# Altium project 175-00060, rev1, NRES Temp Meas, 8-Chan RTD.PrjPcb
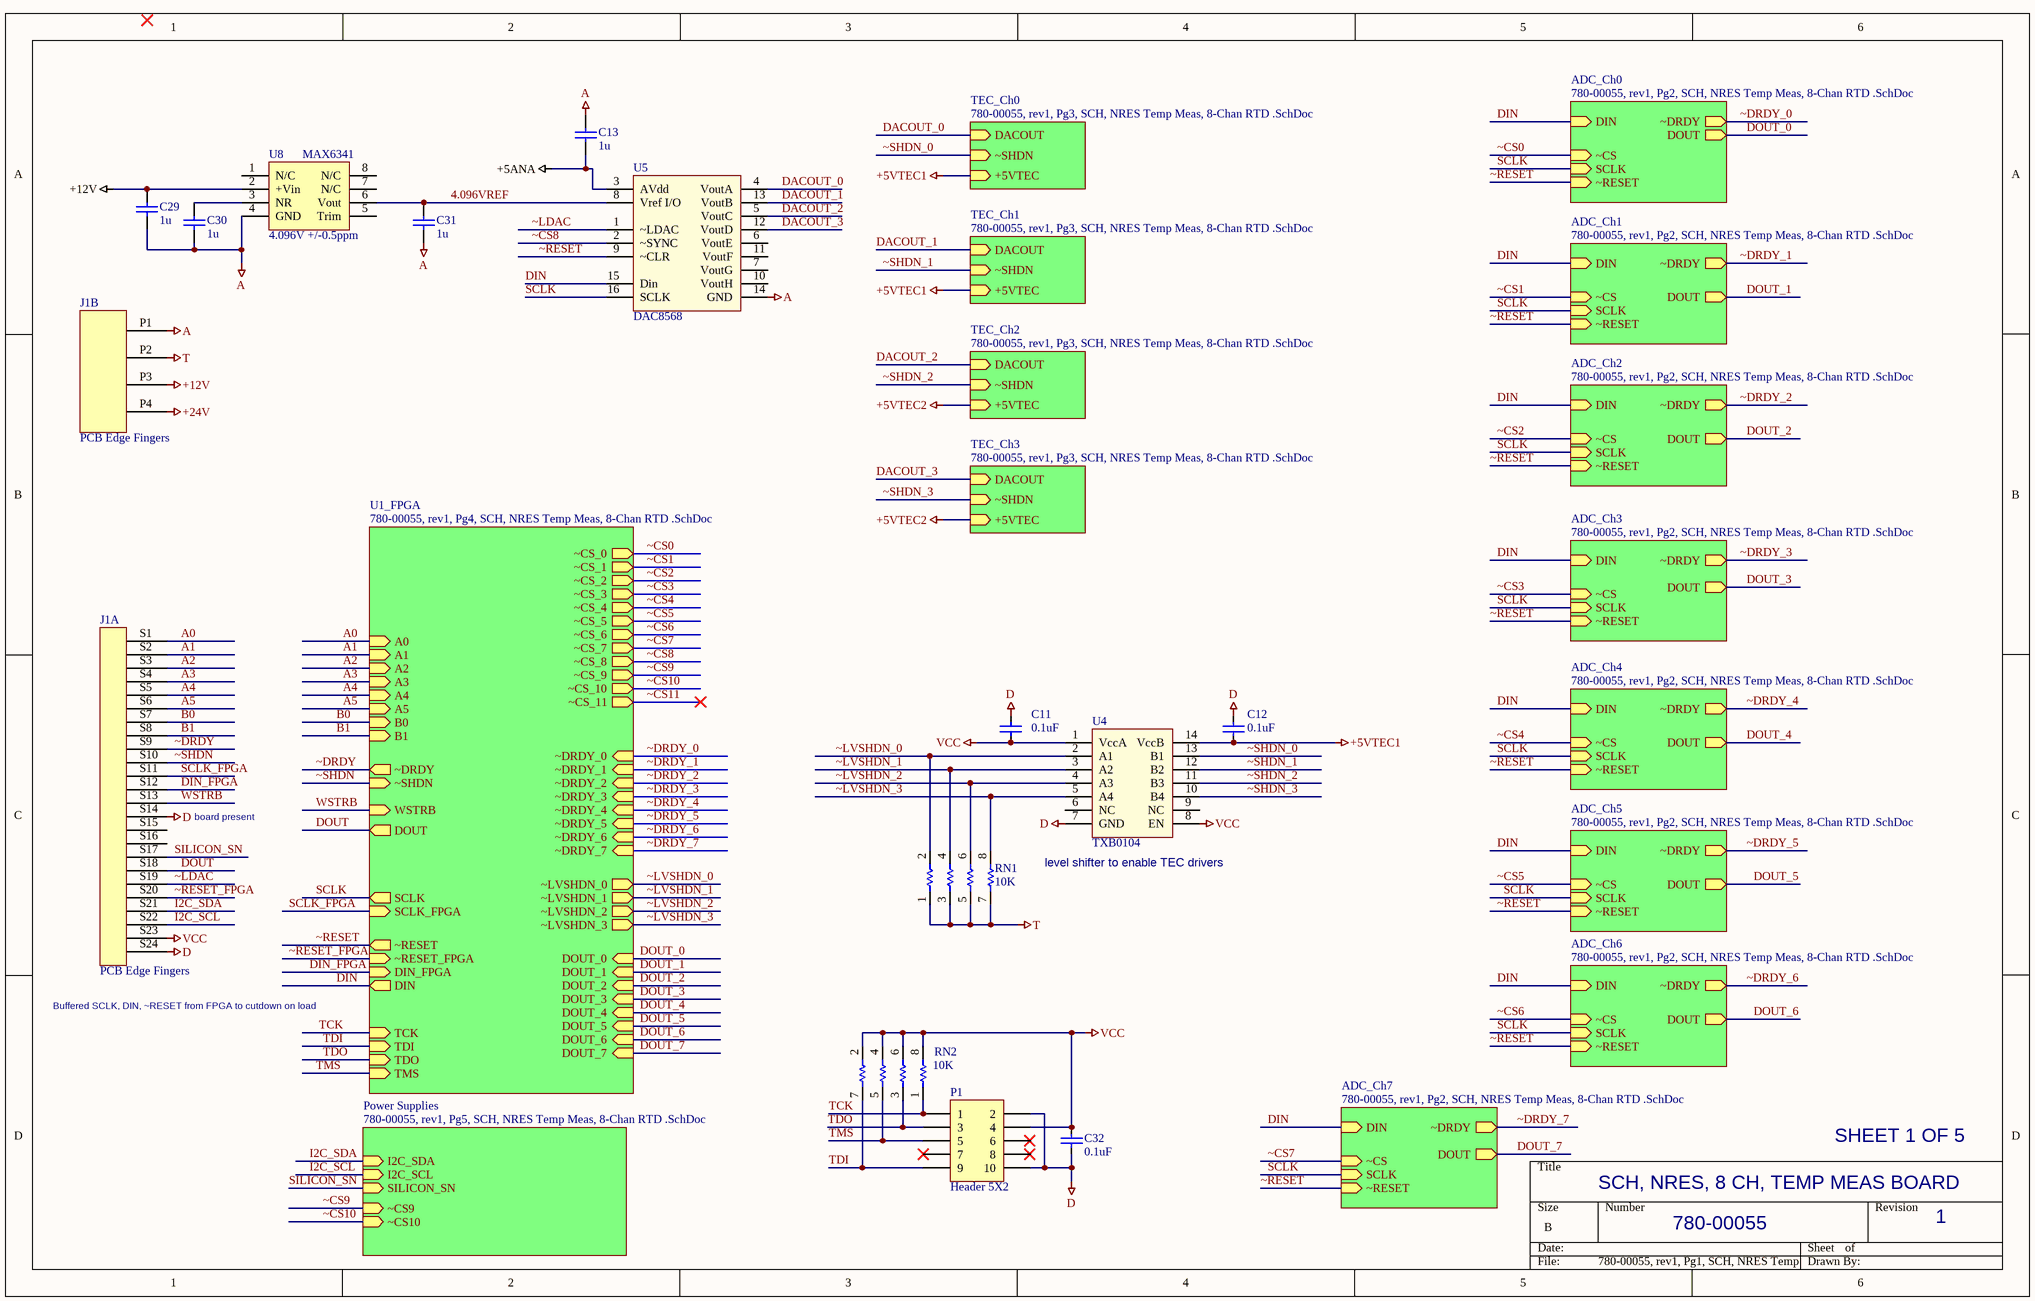
[diagram p0: 780-00055, rev1, Pg1, SCH, NRES Temp Meas, 8-Chan RTD .SchDoc]
4 sheets, 118 parts. Net scope: hierarchical (ports join the sheet entries above them; power ports are global).
Board file: 175-00060, rev1, PCB, NRES RTD_TEC Board.PcbDoc
Sheets:
  780-00055, rev1, Pg1, SCH, NRES Temp Meas, 8-Chan RTD .SchDoc
    TEC_Ch0 = 780-00055, rev1, Pg3, SCH, NRES Temp Meas, 8-Chan RTD .SchDoc
    TEC_Ch1 = 780-00055, rev1, Pg3, SCH, NRES Temp Meas, 8-Chan RTD .SchDoc
    TEC_Ch2 = 780-00055, rev1, Pg3, SCH, NRES Temp Meas, 8-Chan RTD .SchDoc
    TEC_Ch3 = 780-00055, rev1, Pg3, SCH, NRES Temp Meas, 8-Chan RTD .SchDoc
    U1_FPGA = 780-00055, rev1, Pg4, SCH, NRES Temp Meas, 8-Chan RTD .SchDoc
    Power Supplies = 780-00055, rev1, Pg5, SCH, NRES Temp Meas, 8-Chan RTD .SchDoc

## Sheet 780-00055, rev1, Pg1, SCH, NRES Temp Meas, 8-Chan RTD .SchDoc
size B; PageSetup: Record=PageOptions|CenterHorizontal=True|CenterVertical=True|PrintScale=1.09|XCorrection=1.00|YCorrection=1.00|PrintKind=0|BorderSize=5000000|LeftOffset=0|BottomOffset=0|Orientation=2|PaperLength=1000|PaperWidth=1000|Scale=100|PaperSource=7|PrintQuality=-4|MediaType=1|DitherType=10|PaperKind=Ledger|PrintScaleMode=1

### Parts
C11  value 0.1uF  [SMD_0805]  (hidden comment: Cap SMD)
C12  value 0.1uF  [SMD_0805]  (hidden comment: Cap SMD)
C13  1u  [SMD_0805]
C29  1u  [SMD_0805]
C30  1u  [SMD_0805]
C31  1u  [SMD_0805]
C32  value 0.1uF  [SMD_0805]  (hidden comment: Cap SMD)
J1  PCB Edge Fingers  [PCB EDGE, MOLEX 46114]  (parts A,B of 2)
P1  Header 5X2  [HDR2X5]
RN1  value 10K  [RES ARRAY 0603 x 4]  (hidden comment: RES ARRAY  x4 10K)
RN2  value 10K  [RES ARRAY 0603 x 4]  (hidden comment: RES ARRAY  x4)
U4  TXB0104  [TSSOP14]
U5  DAC8568  [TSSOP16]
U8  4.096V +/-0.5ppm  value MAX6341  [SO-8_M]

### Sub-sheets
ADC_Ch0 = 780-00055, rev1, Pg2, SCH, NRES Temp Meas, 8-Chan RTD .SchDoc (file not in this document): SCLK (in), ~RESET (in), DIN (in), ~DRDY (out), DOUT (out), ~CS (in)
ADC_Ch1 = 780-00055, rev1, Pg2, SCH, NRES Temp Meas, 8-Chan RTD .SchDoc (file not in this document): SCLK (in), ~RESET (in), DIN (in), ~DRDY (out), ~CS (in), DOUT (out)
ADC_Ch2 = 780-00055, rev1, Pg2, SCH, NRES Temp Meas, 8-Chan RTD .SchDoc (file not in this document): SCLK (in), ~RESET (in), DIN (in), ~DRDY (out), ~CS (in), DOUT (out)
ADC_Ch3 = 780-00055, rev1, Pg2, SCH, NRES Temp Meas, 8-Chan RTD .SchDoc (file not in this document): SCLK (in), ~RESET (in), DIN (in), ~DRDY (out), ~CS (in), DOUT (out)
ADC_Ch4 = 780-00055, rev1, Pg2, SCH, NRES Temp Meas, 8-Chan RTD .SchDoc (file not in this document): SCLK (in), ~RESET (in), DIN (in), ~DRDY (out), ~CS (in), DOUT (out)
ADC_Ch5 = 780-00055, rev1, Pg2, SCH, NRES Temp Meas, 8-Chan RTD .SchDoc (file not in this document): SCLK (in), ~RESET (in), DIN (in), ~DRDY (out), ~CS (in), DOUT (out)
ADC_Ch6 = 780-00055, rev1, Pg2, SCH, NRES Temp Meas, 8-Chan RTD .SchDoc (file not in this document): SCLK (in), ~RESET (in), DIN (in), ~DRDY (out), ~CS (in), DOUT (out)
ADC_Ch7 = 780-00055, rev1, Pg2, SCH, NRES Temp Meas, 8-Chan RTD .SchDoc (file not in this document): SCLK (in), ~RESET (in), DIN (in), ~DRDY (out), ~CS (in), DOUT (out)
Power Supplies = 780-00055, rev1, Pg5, SCH, NRES Temp Meas, 8-Chan RTD .SchDoc: I2C_SDA (in), I2C_SCL (in), SILICON_SN (in), ~CS9 (in), ~CS10 (in)
TEC_Ch0 = 780-00055, rev1, Pg3, SCH, NRES Temp Meas, 8-Chan RTD .SchDoc: ~SHDN (in), DACOUT (in), +5VTEC (in)
TEC_Ch1 = 780-00055, rev1, Pg3, SCH, NRES Temp Meas, 8-Chan RTD .SchDoc: ~SHDN (in), DACOUT (in), +5VTEC (in)
TEC_Ch2 = 780-00055, rev1, Pg3, SCH, NRES Temp Meas, 8-Chan RTD .SchDoc: ~SHDN (in), DACOUT (in), +5VTEC (in)
TEC_Ch3 = 780-00055, rev1, Pg3, SCH, NRES Temp Meas, 8-Chan RTD .SchDoc: ~SHDN (in), DACOUT (in), +5VTEC (in)
U1_FPGA = 780-00055, rev1, Pg4, SCH, NRES Temp Meas, 8-Chan RTD .SchDoc: ~CS_0 (out), ~CS_1 (out), ~CS_2 (out), ~CS_3 (out), ~CS_4 (out), ~CS_5 (out), ~CS_6 (out), ~CS_7 (out), ~CS_8 (out), ~DRDY (out), ~DRDY_0 (in), ~DRDY_1 (in), ~DRDY_2 (in), ~DRDY_3 (in), ~DRDY_4 (in), ~DRDY_5 (in), ~DRDY_6 (in), ~DRDY_7 (in), ~LVSHDN_0 (out), ~LVSHDN_1 (out), ~LVSHDN_2 (out), ~LVSHDN_3 (out), ~SHDN (in), A0 (in), A1 (in), A2 (in), A3 (in), A4 (in), A5 (in), B0 (in), B1 (in), TCK (in), TDI (in), TDO (in), TMS (in), WSTRB (in), DOUT (out), ~CS_9 (out), ~CS_10 (out), ~CS_11 (out), DOUT_2 (in), DOUT_4 (in), DOUT_1 (in), DOUT_6 (in), DOUT_3 (in), DOUT_7 (in), DOUT_0 (in), DOUT_5 (in), SCLK (out), SCLK_FPGA (in), ~RESET (out), ~RESET_FPGA (in), DIN_FPGA (in), DIN (out)

### Nets
+5ANA: C13.2 U5.3(AVdd)
+5VTEC1: C12.1 U4.14(VccB) ; sheet TEC_Ch0/+5VTEC, sheet TEC_Ch1/+5VTEC
+5VTEC2: sheet TEC_Ch2/+5VTEC, sheet TEC_Ch3/+5VTEC
+12V: C29.1 J1.P3(S27) U8.2(+Vin)
+24V: J1.P4(S28)
A: C13.1 C29.2 C30.2 C31.2 J1.P1(S25) U5.14(GND) U8.4(GND)
D: C11.2 C12.2 C32.1 J1.S14 J1.S24 P1.2 P1.10 U4.7(GND)
T: J1.P2(S26) RN1.1 RN1.3 RN1.5 RN1.7
VCC: C11.1 C32.2 J1.S23 P1.4 RN2.2 RN2.4 RN2.6 RN2.8 U4.1(VccA) U4.8(EN)
4.096VREF: C31.1 U5.8(Vref_I/O) U8.6(Vout)
A0: J1.S1 ; sheet U1_FPGA/A0
A1: J1.S2 ; sheet U1_FPGA/A1
A2: J1.S3 ; sheet U1_FPGA/A2
A3: J1.S4 ; sheet U1_FPGA/A3
A4: J1.S5 ; sheet U1_FPGA/A4
A5: J1.S6 ; sheet U1_FPGA/A5
B0: J1.S7 ; sheet U1_FPGA/B0
B1: J1.S8 ; sheet U1_FPGA/B1
DACOUT_0: U5.4(VoutA) ; sheet TEC_Ch0/DACOUT  [project net DACOUT]
DACOUT_1: U5.13(VoutB) ; sheet TEC_Ch1/DACOUT  [project net DACOUT]
DACOUT_2: U5.5(VoutC) ; sheet TEC_Ch2/DACOUT  [project net DACOUT]
DACOUT_3: U5.12(VoutD) ; sheet TEC_Ch3/DACOUT  [project net DACOUT]
DIN: U5.15(Din) ; sheet ADC_Ch3/DIN, sheet ADC_Ch4/DIN, sheet ADC_Ch5/DIN, sheet ADC_Ch6/DIN, sheet ADC_Ch7/DIN, sheet ADC_Ch0/DIN, sheet ADC_Ch1/DIN, sheet ADC_Ch2/DIN, sheet U1_FPGA/DIN
DIN_FPGA: J1.S12 ; sheet U1_FPGA/DIN_FPGA
DOUT: J1.S18 ; sheet U1_FPGA/DOUT
DOUT_0: sheet ADC_Ch0/DOUT, sheet U1_FPGA/DOUT_0
DOUT_1: sheet ADC_Ch1/DOUT, sheet U1_FPGA/DOUT_1
DOUT_2: sheet ADC_Ch2/DOUT, sheet U1_FPGA/DOUT_2
DOUT_3: sheet ADC_Ch3/DOUT, sheet U1_FPGA/DOUT_3
DOUT_4: sheet ADC_Ch4/DOUT, sheet U1_FPGA/DOUT_4
DOUT_5: sheet ADC_Ch5/DOUT, sheet U1_FPGA/DOUT_5
DOUT_6: sheet ADC_Ch6/DOUT, sheet U1_FPGA/DOUT_6
DOUT_7: sheet ADC_Ch7/DOUT, sheet U1_FPGA/DOUT_7
I2C_SCL: J1.S22 ; sheet Power Supplies/I2C_SCL
I2C_SDA: J1.S21 ; sheet Power Supplies/I2C_SDA
SCLK: U5.16(SCLK) ; sheet ADC_Ch3/SCLK, sheet ADC_Ch4/SCLK, sheet ADC_Ch5/SCLK, sheet ADC_Ch6/SCLK, sheet ADC_Ch7/SCLK, sheet ADC_Ch0/SCLK, sheet ADC_Ch1/SCLK, sheet ADC_Ch2/SCLK, sheet U1_FPGA/SCLK
SCLK_FPGA: J1.S11 ; sheet U1_FPGA/SCLK_FPGA
SILICON_SN: J1.S17 ; sheet Power Supplies/SILICON_SN
TCK: P1.1 RN2.1 ; sheet U1_FPGA/TCK
TDI: P1.9 RN2.7 ; sheet U1_FPGA/TDI
TDO: P1.3 RN2.3 ; sheet U1_FPGA/TDO
TMS: P1.5 RN2.5 ; sheet U1_FPGA/TMS
WSTRB: J1.S13 ; sheet U1_FPGA/WSTRB
~CS0: sheet ADC_Ch0/~CS, sheet U1_FPGA/~CS_0
~CS1: sheet ADC_Ch1/~CS, sheet U1_FPGA/~CS_1
~CS2: sheet ADC_Ch2/~CS, sheet U1_FPGA/~CS_2
~CS3: sheet ADC_Ch3/~CS, sheet U1_FPGA/~CS_3
~CS4: sheet ADC_Ch4/~CS, sheet U1_FPGA/~CS_4
~CS5: sheet ADC_Ch5/~CS, sheet U1_FPGA/~CS_5
~CS6: sheet ADC_Ch6/~CS, sheet U1_FPGA/~CS_6
~CS7: sheet ADC_Ch7/~CS, sheet U1_FPGA/~CS_7
~CS8: U5.2(~SYNC) ; sheet U1_FPGA/~CS_8
~CS9: sheet U1_FPGA/~CS_9, sheet Power Supplies/~CS9
~CS10: sheet U1_FPGA/~CS_10, sheet Power Supplies/~CS10
~DRDY: J1.S9 ; sheet U1_FPGA/~DRDY
~DRDY_0: sheet ADC_Ch0/~DRDY, sheet U1_FPGA/~DRDY_0
~DRDY_1: sheet ADC_Ch1/~DRDY, sheet U1_FPGA/~DRDY_1
~DRDY_2: sheet ADC_Ch2/~DRDY, sheet U1_FPGA/~DRDY_2
~DRDY_3: sheet ADC_Ch3/~DRDY, sheet U1_FPGA/~DRDY_3
~DRDY_4: sheet ADC_Ch4/~DRDY, sheet U1_FPGA/~DRDY_4
~DRDY_5: sheet ADC_Ch5/~DRDY, sheet U1_FPGA/~DRDY_5
~DRDY_6: sheet ADC_Ch6/~DRDY, sheet U1_FPGA/~DRDY_6
~DRDY_7: sheet ADC_Ch7/~DRDY, sheet U1_FPGA/~DRDY_7
~LDAC: J1.S19 U5.1(~LDAC)
~LVSHDN_0: RN1.2 U4.2(A1) ; sheet U1_FPGA/~LVSHDN_0
~LVSHDN_1: RN1.4 U4.3(A2) ; sheet U1_FPGA/~LVSHDN_1
~LVSHDN_2: RN1.6 U4.4(A3) ; sheet U1_FPGA/~LVSHDN_2
~LVSHDN_3: RN1.8 U4.5(A4) ; sheet U1_FPGA/~LVSHDN_3
~RESET: U5.9(~CLR) ; sheet ADC_Ch3/~RESET, sheet ADC_Ch4/~RESET, sheet ADC_Ch5/~RESET, sheet ADC_Ch6/~RESET, sheet ADC_Ch7/~RESET, sheet ADC_Ch0/~RESET, sheet ADC_Ch1/~RESET, sheet ADC_Ch2/~RESET, sheet U1_FPGA/~RESET
~RESET_FPGA: J1.S20 ; sheet U1_FPGA/~RESET_FPGA
~SHDN: J1.S10 ; sheet U1_FPGA/~SHDN
~SHDN_0: U4.13(B1) ; sheet TEC_Ch0/~SHDN  [project net ~SHDN]
~SHDN_1: U4.12(B2) ; sheet TEC_Ch1/~SHDN  [project net ~SHDN]
~SHDN_2: U4.11(B3) ; sheet TEC_Ch2/~SHDN  [project net ~SHDN]
~SHDN_3: U4.10(B4) ; sheet TEC_Ch3/~SHDN  [project net ~SHDN]
NetC30_1: C30.1 U8.3(NR)

Not connected (* = marked no-connect by the designer): J1 S15 S16; P1 6 7* 8; U4 6(NC) 9(NC); U5 6(VoutE) 7(VoutG) 10(VoutH) 11(VoutF); U8 1(N/C) 5(Trim) 7(N/C) 8(N/C)

### Notes on the sheet
- board present
- level shifter to enable TEC drivers
- (near J1) Buffered SCLK, DIN, ~RESET from FPGA to cutdown on load
- SCH, NRES, 8 CH, TEMP MEAS BOARD
- SHEET 1 OF 5
- 780-00055
- 1

### Library data of the parts
C11 C12 = Cap SMD: Capacitor; LCO p/n: 120-00002
C13 C29-C31 = Cap: Capacitor; Manufacturer: Taiyo Yuden; Manuf p/n: UMK212F105ZG-T; Vendor: DIGIKEY; Vendor Mult.: 10; Vendor p/n: 587-1308-1-ND; LCO p/n: 120-00027; Value: 1u; COST: 0.088
C32 = Cap SMD: Capacitor; Manufacturer: AVX; Manuf p/n: 08055C104KAT2A; Vendor: DigiKey; Vendor p/n: 478-1395-1-ND; Vendor Mult.: 10; LCO P/N: 120-00002; COST: 0.088
J1 = Conn, PCB Card Edge / Molex 46114, 24 sig / 4 pwr: PCB Edge Conn to fit Molex 46114 backplane connector
P1 = Header 5X2: Header, 5-Pin, Dual row; Manufacturer: FCI; Manuf p/n: 67996-210HLF; Vendor: DigiKey; Vendor p/n: 609-3212-ND; Vendor Mult.: 1; LCO P/N: 125-00010; COST: 0.81; Value: Header 5X2
RN1 = RES ARRAY  x4 10K: Resistor Array 4 Isolated; Manufacturer: PANASONIC - ECG; Manuf p/n: EXB-38V103JV; Vendor: DIGIKEY; Vendor p/n: Y9103CT-ND; Vendor Mult.: 10; LCO p/n: 180-00043; COST: 0.03
RN2 = RES ARRAY  x4: Resistor Array 4 Isolated; Manufacturer: Panasonic ECG; Manuf p/n: EXB-38V103JV; Vendor: DigiKey; Vendor p/n: Y9103CT-ND; Vendor Mult.: 10; LCO P/N: 180-00043; COST: 0.031
U4 = TXB0104: 4-Chan Logic Level Shifter Bi-directional; Manufacturer: TI; Manuf p/n: TXB0104PWR; LCO p/n: 150-00108; Vendor: DK; Vendor p/n: 296-21929-1-ND; VALUE: TXB0104
U5 = DAC8568: 8 Chan, 16-bit DAC, SPI Interface; Manufacturer: TI; Manuf p/n: DAC8568IAPW; LCO p/n: 150-00107; Vendor: DK; Vendor p/n: 296-24444-5-ND; VALUE: DAC8568
U8 = MAX6341: VREF 4.096V 0.5ppm; Manufacturer: MAXIM; Manuf p/n: MAX6341CSA+; Vendor: DIGIKEY; Vendor p/n: MAX6341CSA+-ND; Vendor Mult.: 1; LCO p/n: 150-00052; COST: 17.76

## Sheet 780-00055, rev1, Pg3, SCH, NRES Temp Meas, 8-Chan RTD .SchDoc
size B; PageSetup: Record=PageOptions|CenterHorizontal=True|CenterVertical=True|PrintScale=1.09|XCorrection=1.00|YCorrection=1.00|PrintKind=0|BorderSize=5000000|LeftOffset=0|BottomOffset=0|Orientation=2|PaperLength=1000|PaperWidth=1000|Scale=100|PaperSource=7|PrintQuality=-4|MediaType=1|DitherType=10|PaperKind=Ledger|PrintScaleMode=1
Used 4 times, as channels TEC_Ch0, TEC_Ch1, TEC_Ch2, TEC_Ch3. Parts and nets are listed once, with the designators drawn on the sheet.
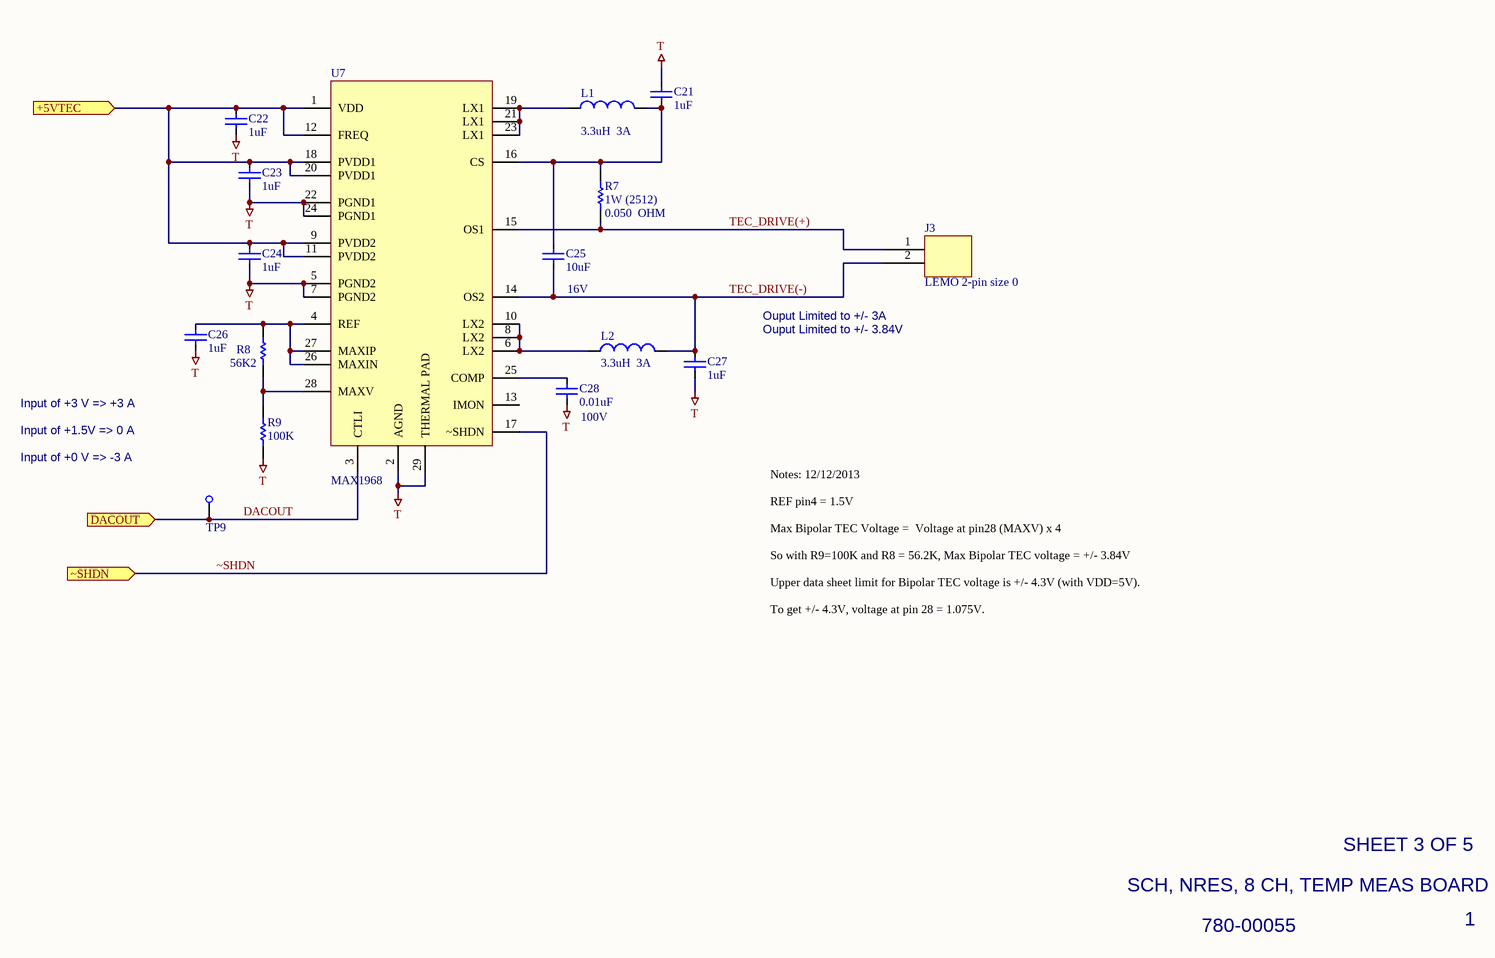
[diagram p1: 780-00055, rev1, Pg3, SCH, NRES Temp Meas, 8-Chan RTD .SchDoc]

### Parts
C21  value 1uF  [SMD_0805]  (hidden comment: Cap SMD)
C22  value 1uF  [SMD_0805]  (hidden comment: Cap SMD)
C23  value 1uF  [SMD_0805]  (hidden comment: Cap SMD)
C24  value 1uF  [SMD_0805]  (hidden comment: Cap SMD)
C25  16V  value 10uF  [SMD_0805]
C26  value 1uF  [SMD_0805]  (hidden comment: Cap SMD)
C27  value 1uF  [SMD_0805]  (hidden comment: Cap SMD)
C28  100V  value 0.01uF  [SMD_0805]
J3  LEMO 2-pin size 0  [LEMO Size 0, 2-pin PCB]
L1  value 3.3uH  3A  [SMT Inductor 7 x 7mm]  (hidden comment: 513-1481-2-ND)
L2  value 3.3uH  3A  [SMT Inductor 7 x 7mm]  (hidden comment: 513-1481-2-ND)
R7  1W (2512)  value 0.050  OHM  [6332[2512]]
R8  value 56K2  [SMD_0805]  (hidden comment: Res 0805)
R9  value 100K  [SMD_0805]  (hidden comment: Res 0805)
TP9  Test point  [PAD_80D_052H]  (value not drawn)
U7  MAX1968  [TSSOP28 Exposed Pad]

### Ports
+5VTEC (in), DACOUT (in), ~SHDN (in)

### Nets
T: C21.2 C22.1 C23.1 C24.1 C26.1 C27.1 C28.1 R9.1 U7.2(AGND) U7.5(PGND2) U7.7(PGND2) U7.22(PGND1) U7.24(PGND1) U7.29(THERMAL_PAD)
+5VTEC: C22.2 C23.2 C24.2 U7.1(VDD) U7.9(PVDD2) U7.11(PVDD2) U7.12(FREQ) U7.18(PVDD1) U7.20(PVDD1) ; port +5VTEC
DACOUT: TP9.1(TP) U7.3(CTLI) ; port DACOUT
TEC_DRIVE(+): J3.1(S29) R7.1 U7.15(OS1)
TEC_DRIVE(-): C25.1 C27.2 J3.2(S30) L2.2 U7.14(OS2)
~SHDN: U7.17(~SHDN) ; port ~SHDN
NetC21_1: C21.1 C25.2 L1.2 R7.2 U7.16(CS)
NetC26_2: C26.2 R8.2 U7.4(REF) U7.26(MAXIN) U7.27(MAXIP)
NetC28_2: C28.2 U7.25(COMP)
NetL1_1: L1.1 U7.19(LX1) U7.21(LX1) U7.23(LX1)
NetL2_1: L2.1 U7.6(LX2) U7.8(LX2) U7.10(LX2)
NetR8_1: R8.1 R9.2 U7.28(MAXV)

Not connected (* = marked no-connect by the designer): U7 13(IMON)

### Channels
TEC_Ch0: designators end in A; ports +5VTEC=+5VTEC1 DACOUT=DACOUT ~SHDN=~SHDN
TEC_Ch1: designators end in B; ports +5VTEC=+5VTEC1 DACOUT=DACOUT ~SHDN=~SHDN
TEC_Ch2: designators end in C; ports +5VTEC=+5VTEC2 DACOUT=DACOUT ~SHDN=~SHDN
TEC_Ch3: designators end in D; ports +5VTEC=+5VTEC2 DACOUT=DACOUT ~SHDN=~SHDN

### Notes on the sheet
- Ouput Limited to +/- 3A
- Ouput Limited to +/- 3.84V
- Input of +3 V => +3 A
- Input of +1.5V => 0 A
- Input of +0 V => -3 A
- Notes: 12/12/2013
  REF pin4 = 1.5V
  Max Bipolar TEC Voltage =  Voltage at pin28 (MAXV) x 4
  So with R9=100K and R8 = 56.2K, Max Bipolar TEC voltage = +/- 3.84V
  Upper data sheet limit for Bipolar TEC voltage is +/- 4.3V (with VDD=5V).
  To get +/- 4.3V, voltage at pin 28 = 1.075V.
- SCH, NRES, 8 CH, TEMP MEAS BOARD
- SHEET 3 OF 5
- 780-00055
- 1

### Library data of the parts
C21-C24 C26 C27 = Cap SMD: Capacitor; LCO p/n: 120-00006
C25 = Cap SMD: Capacitor; LCO p/n: 120-00007
C28 = Cap SMD: Capacitor; Manufacturer: Johanson; Manuf p/n: 101X15W103MV4E; Vendor: Digi-Key; Vendor p/n: 709-1325-1-ND; LCO p/n: 120-00050
J3 = LEMO Size 0, 2 pin, PCB: LCO p/n: 125-00371
L1 L2 = Inductor SMD 7 x 7mm: Inductor; Manufacturer: Coiltronics; Manuf p/n: SD7030-3R3-R; Vendor: Digi-Key; Vendor Mult.: 1; LCO p/n: 155-00007; Vendor p/n: 513-1481-2-ND; COST: 1.03
R7 = Res SMD: Manufacturer: Panasonic; Manuf p/n: ERJ-L1WKF50MU; Vendor: DIGIKEY; Vendor p/n: P50MCT-ND; Vendor Mult.: 1; LCO p/n: 180-00014; COST: 1.07
R8 = Res SMD: Resistor 0805; Manufacturer: Vishay/Dale; Manuf p/n: CRCW080556K2FKEA; Vendor: DIGIKEY; Vendor p/n: 541-56K2CCT-ND; Vendor Mult.: 10; LCO p/n: 181-05622; COST: 0.09
R9 = Res SMD: Resistor 0805; Manufacturer: Vishay/Dale; Manuf p/n: CRCW0805100KFKEA; Vendor: DIGIKEY; Vendor p/n: 541-100KCCT-ND; Vendor Mult.: 10; LCO p/n: 181-01003; COST: 0.09
TP9 = Test point: Manufacturer: Keystone; Manuf p/n: 1249; Vendor: Bisco Ind.; LCO p/n: 125-00013; Vendor p/n: 1249; COST: 0.18; VALUE: Test point
U7 = MAX1968: TEC Driver +/- 3A; Manufacturer: Maxim; Manuf p/n: MAX1968EUI+; LCO p/n: 150-00096; Vendor: digikey; Vendor p/n: MAX1968EUI+-ND; VALUE: MAX1968

## Sheet 780-00055, rev1, Pg4, SCH, NRES Temp Meas, 8-Chan RTD .SchDoc
size B; PageSetup: Record=PageOptions|CenterHorizontal=True|CenterVertical=True|PrintScale=1.09|XCorrection=1.00|YCorrection=1.00|PrintKind=0|BorderSize=5000000|LeftOffset=0|BottomOffset=0|Orientation=2|PaperLength=1000|PaperWidth=1000|Scale=100|PaperSource=7|PrintQuality=-4|MediaType=1|DitherType=10|PaperKind=Ledger|PrintScaleMode=1
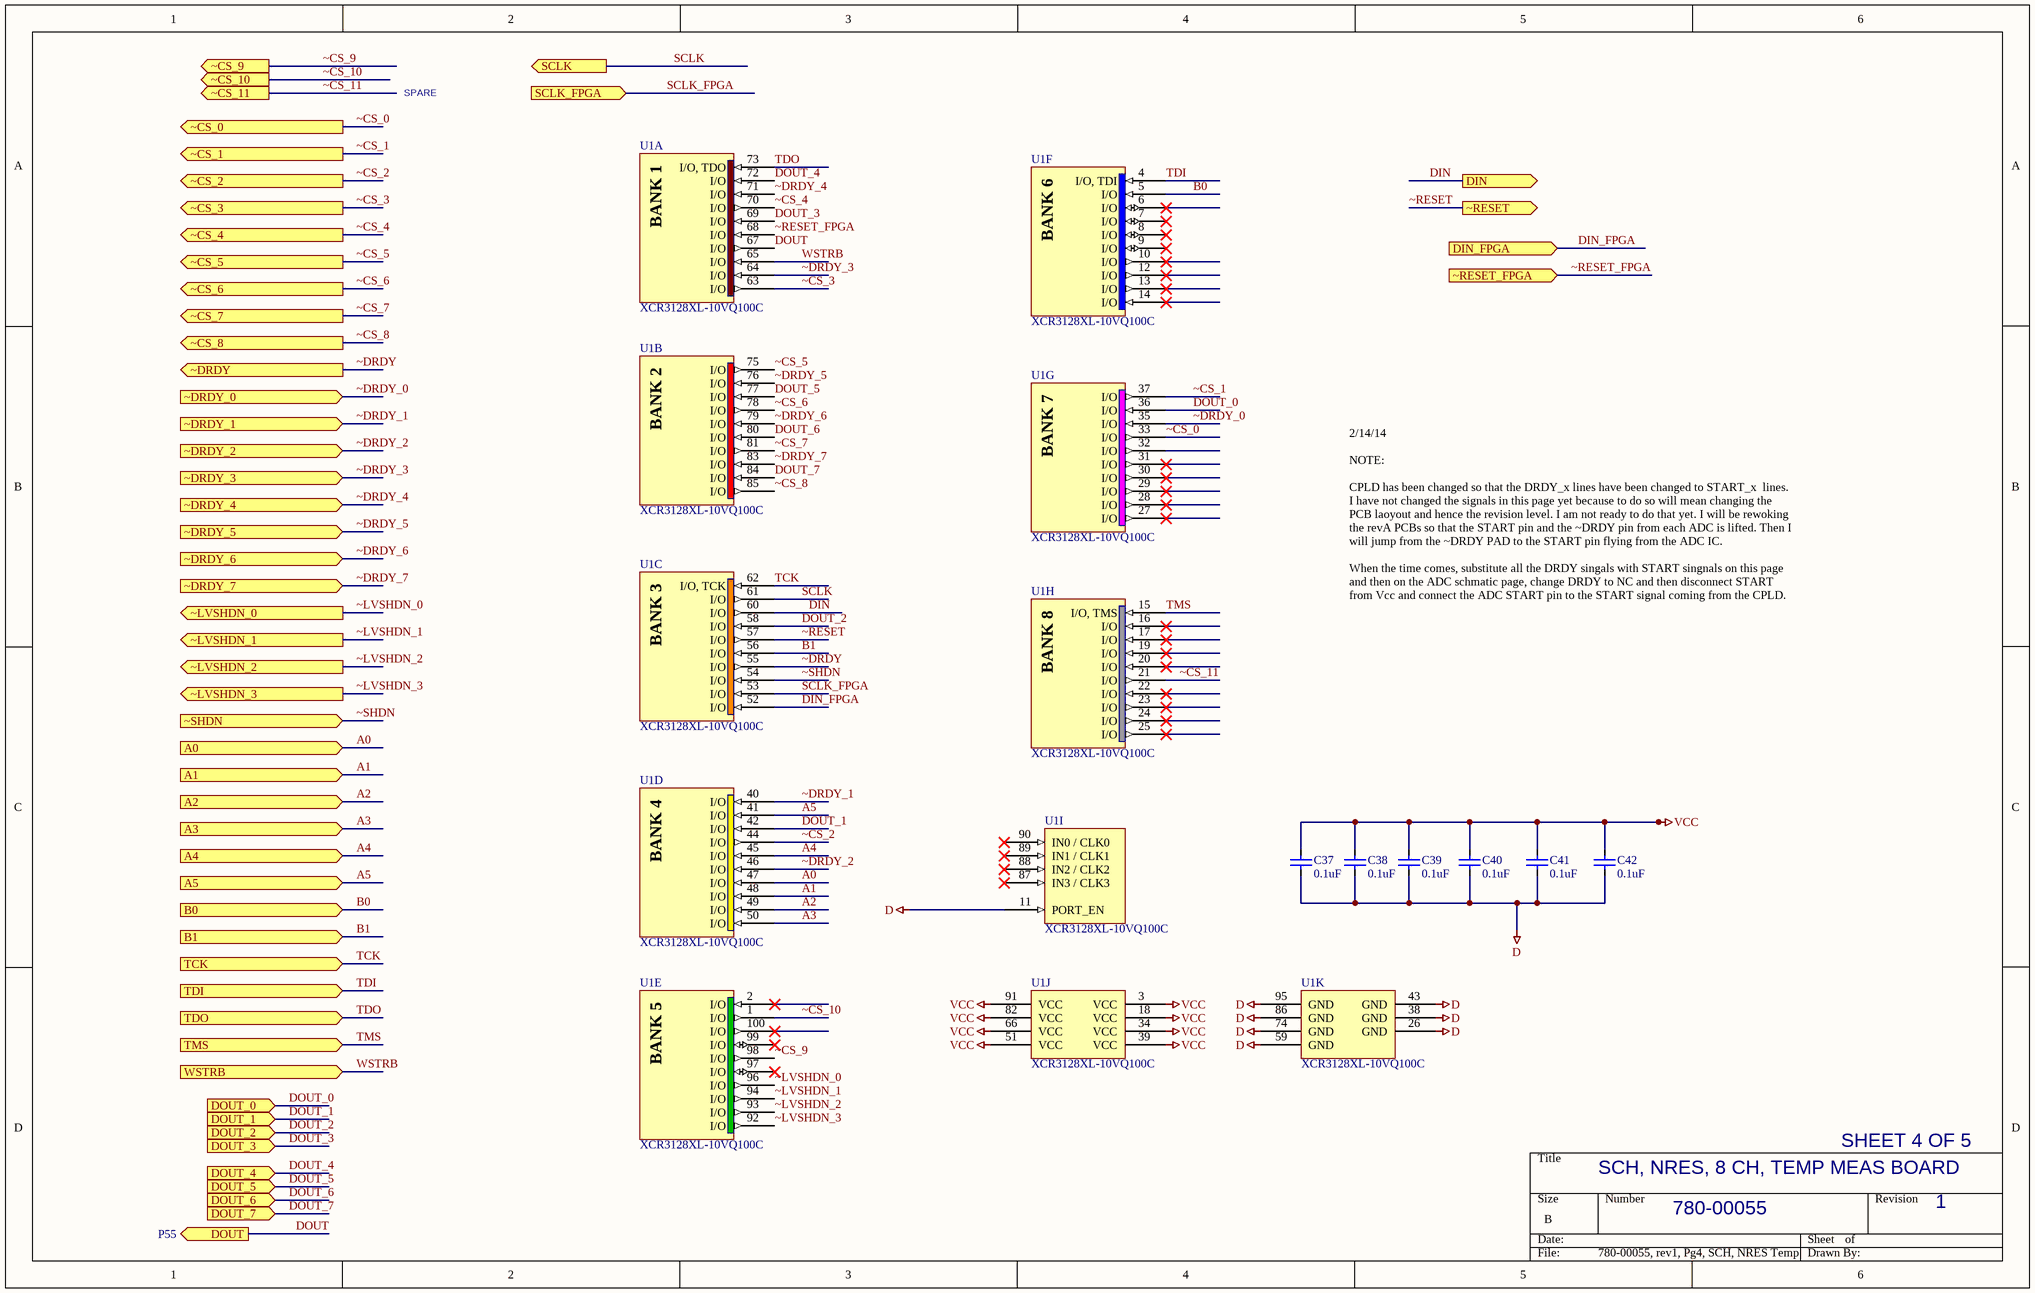
[diagram p2: 780-00055, rev1, Pg4, SCH, NRES Temp Meas, 8-Chan RTD .SchDoc]

### Parts
C37  value 0.1uF  [SMD_0805]  (hidden comment: Cap SMD)
C38  value 0.1uF  [SMD_0805]  (hidden comment: Cap SMD)
C39  value 0.1uF  [SMD_0805]  (hidden comment: Cap SMD)
C40  value 0.1uF  [SMD_0805]  (hidden comment: Cap SMD)
C41  value 0.1uF  [SMD_0805]  (hidden comment: Cap SMD)
C42  value 0.1uF  [SMD_0805]  (hidden comment: Cap SMD)
U1  XCR3128XL-10VQ100C  [VQ100_N]  (parts A,B,C,D,E,F,G,H,I,J,K of 11)

### Ports
A0 (in), A1 (in), A2 (in), A3 (in), A4 (in), A5 (in), B0 (in), B1 (in), DIN (out), DIN_FPGA (in), DOUT (out, see P55), DOUT_0 (in), DOUT_1 (in), DOUT_2 (in), DOUT_3 (in), DOUT_4 (in), DOUT_5 (in), DOUT_6 (in), DOUT_7 (in), SCLK (out), SCLK_FPGA (in), TCK (in), TDI (in), TDO (in), TMS (in), WSTRB (in), ~CS_0 (out), ~CS_1 (out), ~CS_2 (out), ~CS_3 (out), ~CS_4 (out), ~CS_5 (out), ~CS_6 (out), ~CS_7 (out), ~CS_8 (out), ~CS_9 (out), ~CS_10 (out), ~CS_11 (out), ~DRDY (out), ~DRDY_0 (in), ~DRDY_1 (in), ~DRDY_2 (in), ~DRDY_3 (in), ~DRDY_4 (in), ~DRDY_5 (in), ~DRDY_6 (in), ~DRDY_7 (in), ~LVSHDN_0 (out), ~LVSHDN_1 (out), ~LVSHDN_2 (out), ~LVSHDN_3 (out), ~RESET (out), ~RESET_FPGA (in), ~SHDN (in)

### Nets
D: C37.1 C38.1 C39.1 C40.1 C41.1 C42.1 U1.11(PORT_EN) U1.26(GND) U1.38(GND) U1.43(GND) U1.59(GND) U1.74(GND) U1.86(GND) U1.95(GND)
VCC: C37.2 C38.2 C39.2 C40.2 C41.2 C42.2 U1.3(VCC) U1.18(VCC) U1.34(VCC) U1.39(VCC) U1.51(VCC) U1.66(VCC) U1.82(VCC) U1.91(VCC)
A0: U1.47(I/O) ; port A0
A1: U1.48(I/O) ; port A1
A2: U1.49(I/O) ; port A2
A3: U1.50(I/O) ; port A3
A4: U1.45(I/O) ; port A4
A5: U1.41(I/O) ; port A5
B0: U1.5(I/O) ; port B0
B1: U1.56(I/O) ; port B1
DIN: U1.60(I/O) ; port DIN
DIN_FPGA: U1.52(I/O) ; port DIN_FPGA
DOUT: U1.67(I/O) ; port DOUT
DOUT_0: U1.36(I/O) ; port DOUT_0
DOUT_1: U1.42(I/O) ; port DOUT_1
DOUT_2: U1.58(I/O) ; port DOUT_2
DOUT_3: U1.69(I/O) ; port DOUT_3
DOUT_4: U1.72(I/O) ; port DOUT_4
DOUT_5: U1.77(I/O) ; port DOUT_5
DOUT_6: U1.80(I/O) ; port DOUT_6
DOUT_7: U1.84(I/O) ; port DOUT_7
SCLK: U1.61(I/O) ; port SCLK
SCLK_FPGA: U1.53(I/O) ; port SCLK_FPGA
TCK: U1.62(I/O,_TCK) ; port TCK
TDI: U1.4(I/O,_TDI) ; port TDI
TDO: U1.73(I/O,_TDO) ; port TDO
TMS: U1.15(I/O,_TMS) ; port TMS
WSTRB: U1.65(I/O) ; port WSTRB
~CS_0: U1.33(I/O) ; port ~CS_0  [project net ~CS0]
~CS_1: U1.37(I/O) ; port ~CS_1  [project net ~CS1]
~CS_2: U1.44(I/O) ; port ~CS_2  [project net ~CS2]
~CS_3: U1.63(I/O) ; port ~CS_3  [project net ~CS3]
~CS_4: U1.70(I/O) ; port ~CS_4  [project net ~CS4]
~CS_5: U1.75(I/O) ; port ~CS_5  [project net ~CS5]
~CS_6: U1.78(I/O) ; port ~CS_6  [project net ~CS6]
~CS_7: U1.81(I/O) ; port ~CS_7  [project net ~CS7]
~CS_8: U1.85(I/O) ; port ~CS_8  [project net ~CS8]
~CS_9: U1.98(I/O) ; port ~CS_9  [project net ~CS9]
~CS_10: U1.1(I/O) ; port ~CS_10  [project net ~CS10]
~CS_11: U1.21(I/O) ; port ~CS_11  [project net ~CS11]
~DRDY: U1.55(I/O) ; port ~DRDY
~DRDY_0: U1.35(I/O) ; port ~DRDY_0
~DRDY_1: U1.40(I/O) ; port ~DRDY_1
~DRDY_2: U1.46(I/O) ; port ~DRDY_2
~DRDY_3: U1.64(I/O) ; port ~DRDY_3
~DRDY_4: U1.71(I/O) ; port ~DRDY_4
~DRDY_5: U1.76(I/O) ; port ~DRDY_5
~DRDY_6: U1.79(I/O) ; port ~DRDY_6
~DRDY_7: U1.83(I/O) ; port ~DRDY_7
~LVSHDN_0: U1.96(I/O) ; port ~LVSHDN_0
~LVSHDN_1: U1.94(I/O) ; port ~LVSHDN_1
~LVSHDN_2: U1.93(I/O) ; port ~LVSHDN_2
~LVSHDN_3: U1.92(I/O) ; port ~LVSHDN_3
~RESET: U1.57(I/O) ; port ~RESET
~RESET_FPGA: U1.68(I/O) ; port ~RESET_FPGA
~SHDN: U1.54(I/O) ; port ~SHDN

Not connected (* = marked no-connect by the designer): U1 2(I/O)* 6(I/O)* 7(I/O)* 8(I/O)* 9(I/O)* 10(I/O)* 12(I/O)* 13(I/O)* 14(I/O)* 16(I/O)* 17(I/O)* 19(I/O)* 20(I/O)* 22(I/O)* 23(I/O)* 24(I/O)* 25(I/O)* 27(I/O)* 28(I/O)* 29(I/O)* 30(I/O)* 31(I/O)* 32(I/O) 87(IN3_/_CLK3)* 88(IN2_/_CLK2)* 89(IN1_/_CLK1)* 90(IN0_/_CLK0)* 97(I/O)* 99(I/O)* 100(I/O)*

### Notes on the sheet
- SPARE
- 2/14/14
  NOTE:
  CPLD has been changed so that the DRDY_x lines have been changed to START_x  lines. I have not changed the signals in this page yet because to do so will mean changing the PCB laoyout and hence the revision level. I am not ready to do that yet. I will be rewoking the revA PCBs so that the START pin and the ~DRDY pin from each ADC is lifted. Then I will jump from the ~DRDY PAD to the START pin flying from the ADC IC.
  When the time comes, substitute all the DRDY singals with START singnals on this page and then on the ADC schmatic page, change DRDY to NC and then disconnect START from Vcc and connect the ADC START pin to the START signal coming from the CPLD.
- SCH, NRES, 8 CH, TEMP MEAS BOARD
- SHEET 4 OF 5
- 780-00055
- 1
- (in symbol XCR3128XL-10VQ100C, part A) BANK 1
- (in symbol XCR3128XL-10VQ100C, part B) BANK 2
- (in symbol XCR3128XL-10VQ100C, part C) BANK 3
- (in symbol XCR3128XL-10VQ100C, part D) BANK 4
- (in symbol XCR3128XL-10VQ100C, part E) BANK 5
- (in symbol XCR3128XL-10VQ100C, part F) BANK 6
- (in symbol XCR3128XL-10VQ100C, part G) BANK 7
- (in symbol XCR3128XL-10VQ100C, part H) BANK 8

### Library data of the parts
C37-C42 = Cap SMD: as C32 on sheet 780-00055, rev1, Pg1, SCH, NRES Temp Meas, 8-Chan RTD ; COST: 0.088
U1 = XCR3128XL-10VQ100C: CoolRunner XPLA3 3.3V, 128 Macrocell CPLD, 84 User I/Os, 100-Pin VQFP, Commercial Grade; LCO p/n: 150-00001

## Sheet 780-00055, rev1, Pg5, SCH, NRES Temp Meas, 8-Chan RTD .SchDoc
size B; PageSetup: Record=PageOptions|CenterHorizontal=True|CenterVertical=True|PrintScale=1.09|XCorrection=1.00|YCorrection=1.00|PrintKind=0|BorderSize=5000000|LeftOffset=0|BottomOffset=0|Orientation=2|PaperLength=1000|PaperWidth=1000|Scale=100|PaperSource=7|PrintQuality=-4|MediaType=1|DitherType=10|PaperKind=Ledger|PrintScaleMode=1
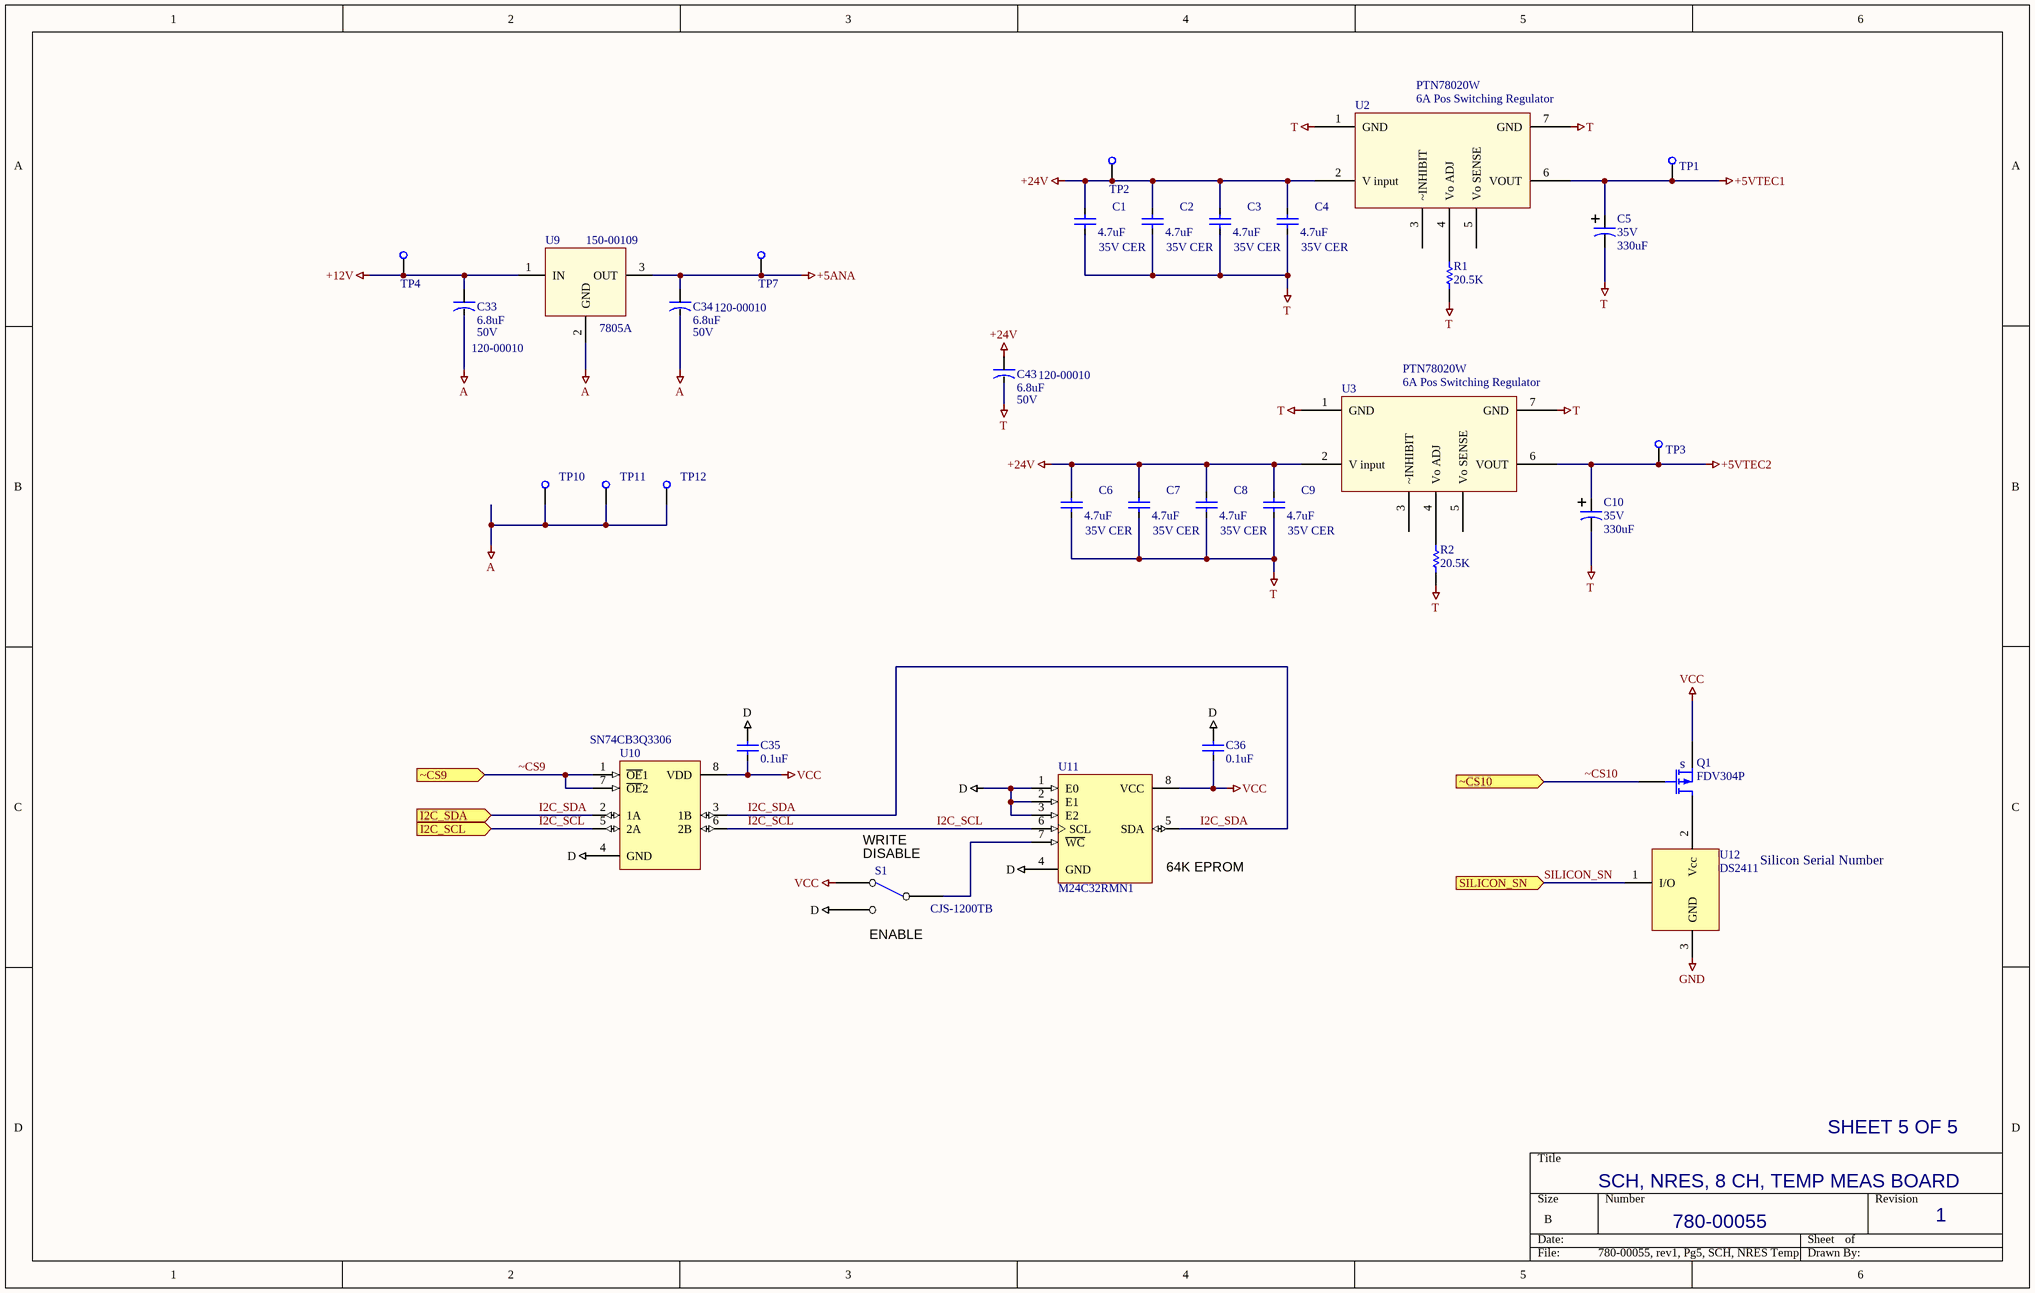
[diagram p3: 780-00055, rev1, Pg5, SCH, NRES Temp Meas, 8-Chan RTD .SchDoc]

### Parts
C1  35V CER  value 4.7uF  [SMD_0805]
C2  35V CER  value 4.7uF  [SMD_0805]
C3  35V CER  value 4.7uF  [SMD_0805]
C4  35V CER  value 4.7uF  [SMD_0805]
C5  35V  value 330uF  [CAP, Thru Hole 10mm dia]
C6  35V CER  value 4.7uF  [SMD_0805]
C7  35V CER  value 4.7uF  [SMD_0805]
C8  35V CER  value 4.7uF  [SMD_0805]
C9  35V CER  value 4.7uF  [SMD_0805]
C10  35V  value 330uF  [CAP, Thru Hole 10mm dia]
C33  50V  value 6.8uF  LCO P/N: 120-00010  [SMD_CAP_6032]
C34  50V  value 6.8uF  LCO P/N: 120-00010  [SMD_CAP_6032]
C35  value 0.1uF  [SMD_0805]  (hidden comment: Cap SMD)
C36  value 0.1uF  [SMD_0805]  (hidden comment: Cap SMD)
C43  50V  value 6.8uF  LCO P/N: 120-00010  [SMD_CAP_6032]
Q1  FDV304P  [SMD_SOT23_3]
R1  value 20.5K  [SMD_0805]  (hidden comment: Res 0805)
R2  value 20.5K  [SMD_0805]  (hidden comment: Res 0805)
S1  CJS-1200TB  [CAS-120B]
TP1  Test point  [PAD_80D_052H]  (value not drawn)
TP2  Test point  [PAD_80D_052H]  (value not drawn)
TP3  Test point  [PAD_80D_052H]  (value not drawn)
TP4  Test point  [PAD_80D_052H]  (value not drawn)
TP7  Test point  [PAD_80D_052H]  (value not drawn)
TP10  Test point  [PAD_80D_052H]  (value not drawn)
TP11  Test point  [PAD_80D_052H]  (value not drawn)
TP12  Test point  [PAD_80D_052H]  (value not drawn)
U2  6A Pos Switching Regulator  value PTN78020W  [TEXAS Inst Switching Regulator]
U3  6A Pos Switching Regulator  value PTN78020W  [TEXAS Inst Switching Regulator]
U9  value 7805A  LCO p/n: 150-00109  [TO-220 w/Heatsink 7136DG]  (hidden comment: Voltage Reg, Pos Fixed)
U10  value SN74CB3Q3306  [PW008_N]  (hidden comment: SN74CBT3306PWLE)
U11  M24C32RMN1  [SOP8_N]
U12  DS2411  [SMD_SOT23_3]

### Ports
I2C_SCL (in), I2C_SDA (in), SILICON_SN (in), ~CS9 (in), ~CS10 (in)

### Nets
+5ANA: C34.pos TP7.1(TP) U9.3(OUT)
+5VTEC1: C5.1 TP1.1(TP) U2.6(VOUT)
+5VTEC2: C10.1 TP3.1(TP) U3.6(VOUT)
+12V: C33.pos TP4.1(TP) U9.1(IN)
+24V: C1.2 C2.2 C3.2 C4.2 C6.2 C7.2 C8.2 C9.2 C43.pos TP2.1(TP) U2.2(V_input) U3.2(V_input)
A: C33.neg C34.neg TP10.1(TP) TP11.1(TP) TP12.1(TP) U9.2(GND)
D: C35.2 C36.2 S1.1(NO) U10.4(GND) U11.1(E0) U11.2(E1) U11.3(E2) U11.4(GND)
GND: U12.3(GND)
T: C1.1 C2.1 C3.1 C4.1 C5.2 C6.1 C7.1 C8.1 C9.1 C10.2 C43.neg R1.1 R2.1 U2.1(GND) U2.7(GND) U3.1(GND) U3.7(GND)
VCC: C35.1 C36.1 Q1.2(S) S1.3(NC) U10.8(VDD) U11.8(VCC)
I2C_SCL: U10.5(2A) U10.6(2B) U11.6(SCL) ; port I2C_SCL
I2C_SDA: U10.2(1A) U10.3(1B) U11.5(SDA) ; port I2C_SDA
SILICON_SN: U12.1(I/O) ; port SILICON_SN
~CS9: U10.1(~{OE}1) U10.7(~{OE}2) ; port ~CS9
~CS10: Q1.1(G) ; port ~CS10
NetQ1_3: Q1.3(D) U12.2(Vcc)
NetR1_2: R1.2 U2.4(Vo_ADJ)
NetR2_2: R2.2 U3.4(Vo_ADJ)
NetS1_2: S1.2(COM) U11.7(~{WC})

Not connected (* = marked no-connect by the designer): U2 3(~INHIBIT) 5(Vo_SENSE); U3 3(~INHIBIT) 5(Vo_SENSE)

### Notes on the sheet
- (near S1) WRITE
- (near S1) DISABLE
- (near U11) 64K EPROM
- Silicon Serial Number
- (near S1) ENABLE
- SHEET 5 OF 5
- SCH, NRES, 8 CH, TEMP MEAS BOARD
- 780-00055
- 1
- (in symbol FDV304P) s

### Library data of the parts
C1-C4 C6-C9 = Cap SMD: Capacitor; LCO p/n: 120-00051
C5 C10 = Cap Elec, 330 uF, 35V: Radial Thru hole; LCO p/n: 120-00053
C33 C34 C43 = Cap Tant 35V: outline 6.0mm x 3.2mm; Manufacturer: AVX; Manuf p/n: TAJC685K050RNJ; Vendor: DigiKey; Vendor p/n: 478-4776-1-ND; Vendor Mult.: 1; COST: 1.55
C35 C36 = Cap SMD: as C32 on sheet 780-00055, rev1, Pg1, SCH, NRES Temp Meas, 8-Chan RTD ; COST: 0.088
Q1 = FDV304P: P-MOSFET LOGIC LEVEL; Manufacturer: Fairchild; Vendor: DigiKey; Vendor p/n: FDV304PCT-ND; Vendor Mult.: 1; LCO P/N: 195-00004; COST: 0.46; Manuf p/n: FDV304P; Value: FDV304P
R1 R2 = Res SMD: Resistor 0805; Manufacturer: Vishay/Dale; Manuf p/n: CRCW080520.5KFKEA; Vendor: DIGIKEY; Vendor p/n: 541-20.5KCCT-ND; Vendor Mult.: 10; LCO p/n: 181-02052; COST: 0.09
S1 = SW_SPDT_DOUG: Manufacturer: Copal Electronics; Manuf p/n: CAS-120TB; Vendor: DIGIKEY; Vendor Mult.: 1; LCO p/n: 185-00010; COST: 1.27; Value: SW_SPDT
TP1-TP4 TP7 TP10-TP12 = Test point: as TP9 on sheet 780-00055, rev1, Pg3, SCH, NRES Temp Meas, 8-Chan RTD ; Vendor p/n: 1249; COST: 0.18; VALUE: Test point
U2 U3 = PTN78020W: Pos Adj Switching Regulator; LCO p/n: 150-00088
U9 = Voltage Reg, Pos Fixed: 7805A; Manufacturer: On Semi; Vendor: Digi-Key; Vendor Mult.: 1; COST: 0.61
U10 = SN74CBT3306PWLE: Dual FET Bus Switch; Manufacturer: TI; Manuf p/n: SN74CB3Q3306APWR; LCO p/n: 150-00083; Vendor: Digi-Key; Vendor Mult.: 1; Vendor p/n: 296-15102-1-ND; COST: 0.95
U11 = M24C32RMN1: 32 Kbit Serial I²C Bus EEPROM; LCO p/n: 150-00076
U12 = DS2411: Silicon Serial Number; Manufacturer: MAXIM; Manuf p/n: DS2411R+T&R; Vendor: DIGIKEY; Vendor p/n: DS2411R+CT-ND; Vendor Mult.: 1; LCO p/n: 150-00031; COST: 1.25; VALUE: DS2411

## Nets that join several sheets
+5ANA: 780-00055, rev1, Pg1, SCH, NRES Temp Meas, 8-Chan RTD  (C13.2 U5.3), 780-00055, rev1, Pg5, SCH, NRES Temp Meas, 8-Chan RTD  (C34.pos TP7.1 U9.3)
+5VTEC1: 780-00055, rev1, Pg1, SCH, NRES Temp Meas, 8-Chan RTD  (C12.1 U4.14), TEC_Ch0 (9 pins), TEC_Ch1 (9 pins), 780-00055, rev1, Pg5, SCH, NRES Temp Meas, 8-Chan RTD  (C5.1 TP1.1 U2.6)
+5VTEC2: TEC_Ch2 (9 pins), TEC_Ch3 (9 pins), 780-00055, rev1, Pg5, SCH, NRES Temp Meas, 8-Chan RTD  (C10.1 TP3.1 U3.6)
+12V: 780-00055, rev1, Pg1, SCH, NRES Temp Meas, 8-Chan RTD  (C29.1 J1.P3 U8.2), 780-00055, rev1, Pg5, SCH, NRES Temp Meas, 8-Chan RTD  (C33.pos TP4.1 U9.1)
+24V: 780-00055, rev1, Pg1, SCH, NRES Temp Meas, 8-Chan RTD  (J1.P4), 780-00055, rev1, Pg5, SCH, NRES Temp Meas, 8-Chan RTD  (12 pins)
A: 780-00055, rev1, Pg1, SCH, NRES Temp Meas, 8-Chan RTD  (7 pins), 780-00055, rev1, Pg5, SCH, NRES Temp Meas, 8-Chan RTD  (6 pins)
D: 780-00055, rev1, Pg1, SCH, NRES Temp Meas, 8-Chan RTD  (8 pins), 780-00055, rev1, Pg4, SCH, NRES Temp Meas, 8-Chan RTD  (14 pins), 780-00055, rev1, Pg5, SCH, NRES Temp Meas, 8-Chan RTD  (8 pins)
T: 780-00055, rev1, Pg1, SCH, NRES Temp Meas, 8-Chan RTD  (5 pins), TEC_Ch0 (14 pins), TEC_Ch1 (14 pins), TEC_Ch2 (14 pins), TEC_Ch3 (14 pins), 780-00055, rev1, Pg5, SCH, NRES Temp Meas, 8-Chan RTD  (17 pins)
VCC: 780-00055, rev1, Pg1, SCH, NRES Temp Meas, 8-Chan RTD  (10 pins), 780-00055, rev1, Pg4, SCH, NRES Temp Meas, 8-Chan RTD  (14 pins), 780-00055, rev1, Pg5, SCH, NRES Temp Meas, 8-Chan RTD  (6 pins)
A0: 780-00055, rev1, Pg1, SCH, NRES Temp Meas, 8-Chan RTD  (J1.S1), 780-00055, rev1, Pg4, SCH, NRES Temp Meas, 8-Chan RTD  (U1.47)
A1: 780-00055, rev1, Pg1, SCH, NRES Temp Meas, 8-Chan RTD  (J1.S2), 780-00055, rev1, Pg4, SCH, NRES Temp Meas, 8-Chan RTD  (U1.48)
A2: 780-00055, rev1, Pg1, SCH, NRES Temp Meas, 8-Chan RTD  (J1.S3), 780-00055, rev1, Pg4, SCH, NRES Temp Meas, 8-Chan RTD  (U1.49)
A3: 780-00055, rev1, Pg1, SCH, NRES Temp Meas, 8-Chan RTD  (J1.S4), 780-00055, rev1, Pg4, SCH, NRES Temp Meas, 8-Chan RTD  (U1.50)
A4: 780-00055, rev1, Pg1, SCH, NRES Temp Meas, 8-Chan RTD  (J1.S5), 780-00055, rev1, Pg4, SCH, NRES Temp Meas, 8-Chan RTD  (U1.45)
A5: 780-00055, rev1, Pg1, SCH, NRES Temp Meas, 8-Chan RTD  (J1.S6), 780-00055, rev1, Pg4, SCH, NRES Temp Meas, 8-Chan RTD  (U1.41)
B0: 780-00055, rev1, Pg1, SCH, NRES Temp Meas, 8-Chan RTD  (J1.S7), 780-00055, rev1, Pg4, SCH, NRES Temp Meas, 8-Chan RTD  (U1.5)
B1: 780-00055, rev1, Pg1, SCH, NRES Temp Meas, 8-Chan RTD  (J1.S8), 780-00055, rev1, Pg4, SCH, NRES Temp Meas, 8-Chan RTD  (U1.56)
DACOUT: 780-00055, rev1, Pg1, SCH, NRES Temp Meas, 8-Chan RTD  (U5.4), TEC_Ch0 (TP9A.1 U7A.3)
DACOUT: 780-00055, rev1, Pg1, SCH, NRES Temp Meas, 8-Chan RTD  (U5.5), TEC_Ch2 (TP9C.1 U7C.3)
DACOUT: 780-00055, rev1, Pg1, SCH, NRES Temp Meas, 8-Chan RTD  (U5.12), TEC_Ch3 (TP9D.1 U7D.3)
DACOUT: 780-00055, rev1, Pg1, SCH, NRES Temp Meas, 8-Chan RTD  (U5.13), TEC_Ch1 (TP9B.1 U7B.3)
DIN: 780-00055, rev1, Pg1, SCH, NRES Temp Meas, 8-Chan RTD  (U5.15), 780-00055, rev1, Pg4, SCH, NRES Temp Meas, 8-Chan RTD  (U1.60)
DIN_FPGA: 780-00055, rev1, Pg1, SCH, NRES Temp Meas, 8-Chan RTD  (J1.S12), 780-00055, rev1, Pg4, SCH, NRES Temp Meas, 8-Chan RTD  (U1.52)
DOUT: 780-00055, rev1, Pg1, SCH, NRES Temp Meas, 8-Chan RTD  (J1.S18), 780-00055, rev1, Pg4, SCH, NRES Temp Meas, 8-Chan RTD  (U1.67)
I2C_SCL: 780-00055, rev1, Pg1, SCH, NRES Temp Meas, 8-Chan RTD  (J1.S22), 780-00055, rev1, Pg5, SCH, NRES Temp Meas, 8-Chan RTD  (U10.5 U10.6 U11.6)
I2C_SDA: 780-00055, rev1, Pg1, SCH, NRES Temp Meas, 8-Chan RTD  (J1.S21), 780-00055, rev1, Pg5, SCH, NRES Temp Meas, 8-Chan RTD  (U10.2 U10.3 U11.5)
SCLK: 780-00055, rev1, Pg1, SCH, NRES Temp Meas, 8-Chan RTD  (U5.16), 780-00055, rev1, Pg4, SCH, NRES Temp Meas, 8-Chan RTD  (U1.61)
SCLK_FPGA: 780-00055, rev1, Pg1, SCH, NRES Temp Meas, 8-Chan RTD  (J1.S11), 780-00055, rev1, Pg4, SCH, NRES Temp Meas, 8-Chan RTD  (U1.53)
SILICON_SN: 780-00055, rev1, Pg1, SCH, NRES Temp Meas, 8-Chan RTD  (J1.S17), 780-00055, rev1, Pg5, SCH, NRES Temp Meas, 8-Chan RTD  (U12.1)
TCK: 780-00055, rev1, Pg1, SCH, NRES Temp Meas, 8-Chan RTD  (P1.1 RN2.1), 780-00055, rev1, Pg4, SCH, NRES Temp Meas, 8-Chan RTD  (U1.62)
TDI: 780-00055, rev1, Pg1, SCH, NRES Temp Meas, 8-Chan RTD  (P1.9 RN2.7), 780-00055, rev1, Pg4, SCH, NRES Temp Meas, 8-Chan RTD  (U1.4)
TDO: 780-00055, rev1, Pg1, SCH, NRES Temp Meas, 8-Chan RTD  (P1.3 RN2.3), 780-00055, rev1, Pg4, SCH, NRES Temp Meas, 8-Chan RTD  (U1.73)
TMS: 780-00055, rev1, Pg1, SCH, NRES Temp Meas, 8-Chan RTD  (P1.5 RN2.5), 780-00055, rev1, Pg4, SCH, NRES Temp Meas, 8-Chan RTD  (U1.15)
WSTRB: 780-00055, rev1, Pg1, SCH, NRES Temp Meas, 8-Chan RTD  (J1.S13), 780-00055, rev1, Pg4, SCH, NRES Temp Meas, 8-Chan RTD  (U1.65)
~CS8: 780-00055, rev1, Pg1, SCH, NRES Temp Meas, 8-Chan RTD  (U5.2), 780-00055, rev1, Pg4, SCH, NRES Temp Meas, 8-Chan RTD  (U1.85)
~CS9: 780-00055, rev1, Pg4, SCH, NRES Temp Meas, 8-Chan RTD  (U1.98), 780-00055, rev1, Pg5, SCH, NRES Temp Meas, 8-Chan RTD  (U10.1 U10.7)
~CS10: 780-00055, rev1, Pg4, SCH, NRES Temp Meas, 8-Chan RTD  (U1.1), 780-00055, rev1, Pg5, SCH, NRES Temp Meas, 8-Chan RTD  (Q1.1)
~DRDY: 780-00055, rev1, Pg1, SCH, NRES Temp Meas, 8-Chan RTD  (J1.S9), 780-00055, rev1, Pg4, SCH, NRES Temp Meas, 8-Chan RTD  (U1.55)
~LVSHDN_0: 780-00055, rev1, Pg1, SCH, NRES Temp Meas, 8-Chan RTD  (RN1.2 U4.2), 780-00055, rev1, Pg4, SCH, NRES Temp Meas, 8-Chan RTD  (U1.96)
~LVSHDN_1: 780-00055, rev1, Pg1, SCH, NRES Temp Meas, 8-Chan RTD  (RN1.4 U4.3), 780-00055, rev1, Pg4, SCH, NRES Temp Meas, 8-Chan RTD  (U1.94)
~LVSHDN_2: 780-00055, rev1, Pg1, SCH, NRES Temp Meas, 8-Chan RTD  (RN1.6 U4.4), 780-00055, rev1, Pg4, SCH, NRES Temp Meas, 8-Chan RTD  (U1.93)
~LVSHDN_3: 780-00055, rev1, Pg1, SCH, NRES Temp Meas, 8-Chan RTD  (RN1.8 U4.5), 780-00055, rev1, Pg4, SCH, NRES Temp Meas, 8-Chan RTD  (U1.92)
~RESET: 780-00055, rev1, Pg1, SCH, NRES Temp Meas, 8-Chan RTD  (U5.9), 780-00055, rev1, Pg4, SCH, NRES Temp Meas, 8-Chan RTD  (U1.57)
~RESET_FPGA: 780-00055, rev1, Pg1, SCH, NRES Temp Meas, 8-Chan RTD  (J1.S20), 780-00055, rev1, Pg4, SCH, NRES Temp Meas, 8-Chan RTD  (U1.68)
~SHDN: 780-00055, rev1, Pg1, SCH, NRES Temp Meas, 8-Chan RTD  (U4.10), TEC_Ch3 (U7D.17)
~SHDN: 780-00055, rev1, Pg1, SCH, NRES Temp Meas, 8-Chan RTD  (U4.11), TEC_Ch2 (U7C.17)
~SHDN: 780-00055, rev1, Pg1, SCH, NRES Temp Meas, 8-Chan RTD  (U4.12), TEC_Ch1 (U7B.17)
~SHDN: 780-00055, rev1, Pg1, SCH, NRES Temp Meas, 8-Chan RTD  (U4.13), TEC_Ch0 (U7A.17)
~SHDN: 780-00055, rev1, Pg1, SCH, NRES Temp Meas, 8-Chan RTD  (J1.S10), 780-00055, rev1, Pg4, SCH, NRES Temp Meas, 8-Chan RTD  (U1.54)